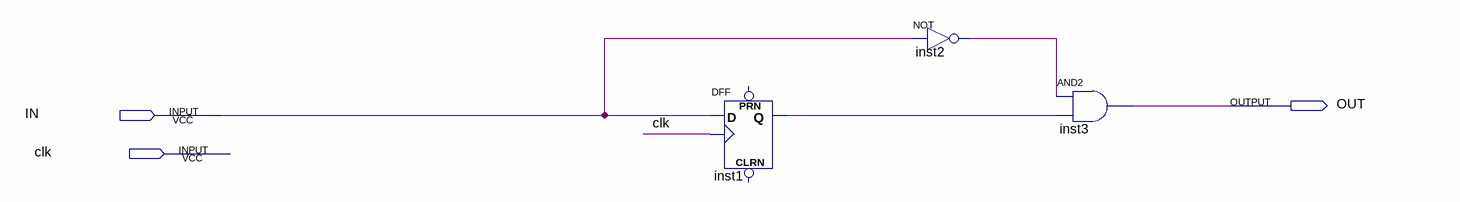
[diagram p0: schematic sheet]
// Quartus schematic FallingEdge.bdf as structural Verilog: 3 symbols, 3 pins
module FallingEdge (
  input  IN,
  input  clk,
  output OUT
);

  wire inst1_q, inst2_out;

  DFF inst1 (.CLK(clk), .D(IN), .Q(inst1_q));  // open: CLRN, PRN
  not inst2 (inst2_out, IN);
  and inst3 (OUT, inst2_out, inst1_q);
endmodule
